# EAGLE design untitled (EAGLE 9.6.2)
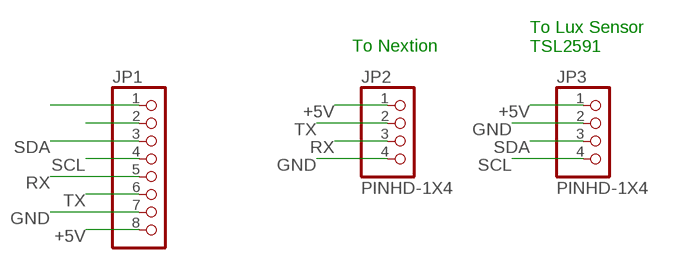
[diagram p0: schematic, sheet 1]

## Parts
JP1  PINHD-1X8BIG  [1X08-BIG]
JP2  PINHD-1X4  [1X04]
JP3  PINHD-1X4  [1X04]

## Nets
+5V: JP1.8 JP2.1 JP3.1
GND: JP1.7 JP2.4 JP3.2
N$7: JP1.2
N$8: JP1.1
RX: JP1.5 JP2.3
SCL: JP1.4 JP3.4
SDA: JP1.3 JP3.3
TX: JP1.6 JP2.2

## Notes on the sheet
- To Nextion
- To Lux Sensor
  TSL2591

## Library data of the parts
JP1 = adafruit:PINHD-1X8: PIN HEADER
JP2 JP3 = Connector:PINHD-1X4: PIN HEADER; CATEGORY: CONNECTOR; SUB-CATEGORY: PIN-HEADER

## Board
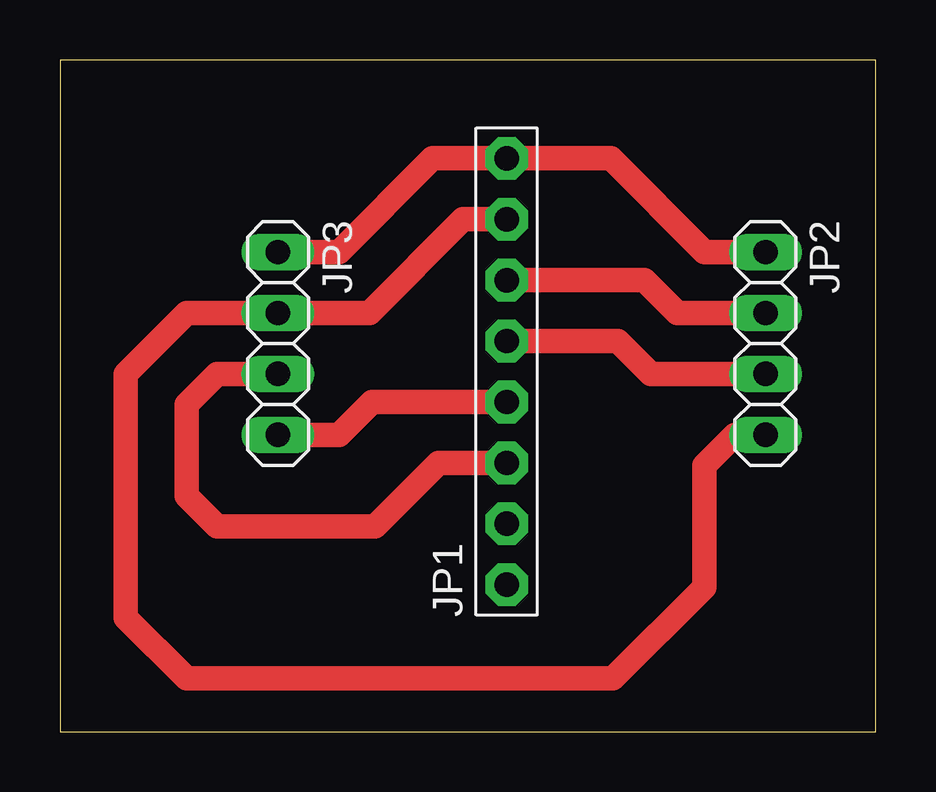
[diagram p1: board, top side]

Size 34 x 28 mm. Coordinates in mm from the lower left corner, seen from the top.
Outline: 0,0 34,0 34,28 0,28 0,0
Copper layers (1*16): Top 0.035mm / dielectric 1.5mm / Bottom 0.035mm
Design rules "default": minimum track width 6mil, minimum drill 0.35mm, track to track 6mil, track to pad 6mil, pad to pad 6mil, via to via 6mil, smd to smd 6mil, copper to edge 40mil, drill to drill 6mil, minimum pad ring 10mil, minimum via ring 8mil, stop-mask expansion 4mil, vias tented up to drill 0mil, thermal gap 10mil

### Footprints (pad centres in the part's own frame; a part is rotated, then mirrored left to right if it is on the bottom)
1X08-BIG = drill 1.016 pad 1.778 octagon: 1 -8.89,0; 2 -6.35,0; 3 -3.81,0; 4 -1.27,0; 5 1.27,0; 6 3.81,0; 7 6.35,0; 8 8.89,0
1X04 = drill 1.016 long: 1 -3.81,0; 2 -1.27,0; 3 1.27,0; 4 3.81,0

### Placement (x,y rotation side)
JP1  18.62,15.01 90 top
JP2  29.41,16.18 270 top
JP3  9.09,16.18 270 top

### Tracks (layer width: path | path; a pad name or v marks a point on that pad's centre or on a via)
+5V
  Top 1.016: JP2.1 26.87,19.99 22.96,23.9 JP1.8 15.54,23.9 11.63,19.99 JP3.1
GND
  Top 1.016: JP1.7 16.81,21.36 12.9,17.45 JP3.2 5.28,17.45 2.74,14.91 2.74,4.75 5.28,2.21 23.06,2.21 26.87,6.02 26.87,11.1 28.14,12.37 JP2.4
RX
  Top 1.016: JP2.3 24.64,14.91 23.27,16.28 JP1.5
SCL
  Top 1.016: JP3.4 11.63,12.37 13,13.74 JP1.4
SDA
  Top 1.016: JP3.3 6.55,14.91 5.28,13.64 5.28,9.83 6.55,8.56 13.14,8.56 15.78,11.2 JP1.3
TX
  Top 1.016: JP2.2 25.74,17.45 24.37,18.82 JP1.6